# EAGLE schematic GPIO_Splitter (EAGLE 7.1.0)
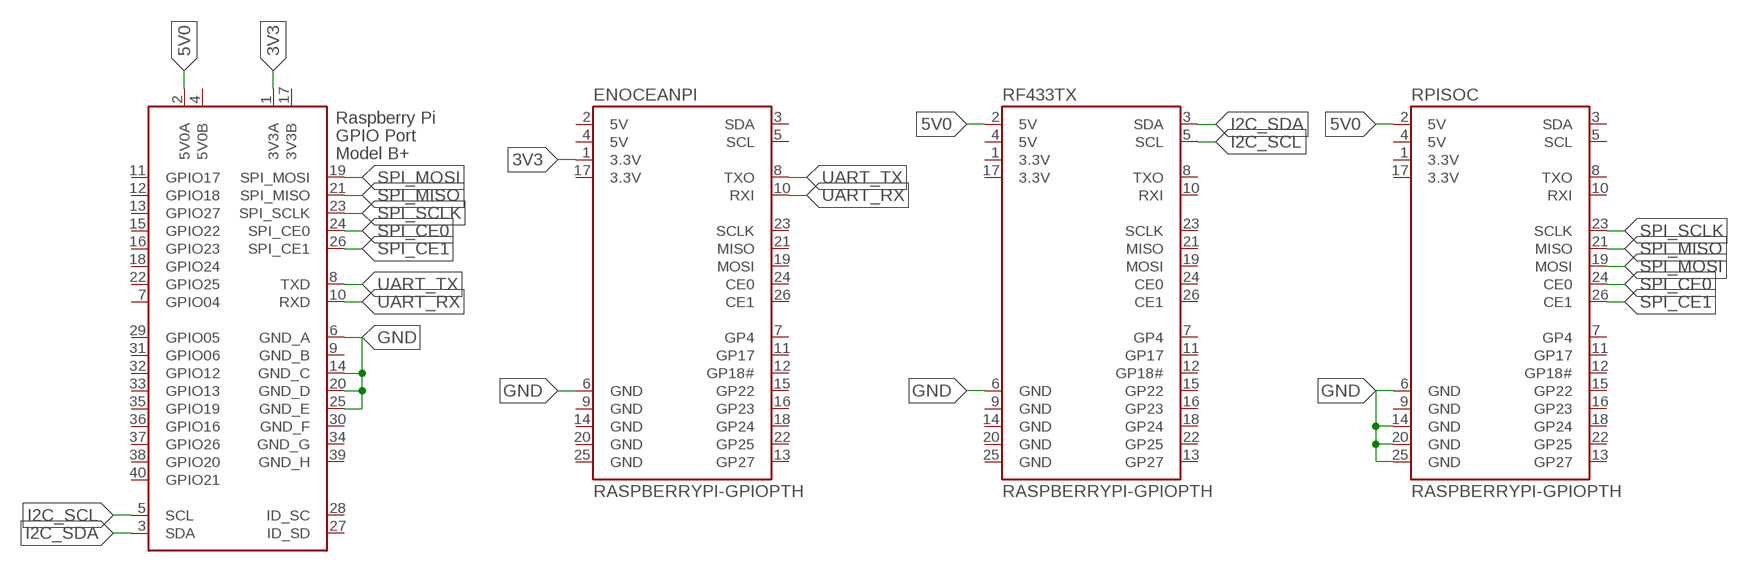
[diagram p0: schematic, sheet 1]

## Parts
ENOCEANPI  RASPBERRYPI-GPIOPTH  [2X13-SHROUDED]
RF433TX  RASPBERRYPI-GPIOPTH  [2X13-SHROUDED]
RPISOC  RASPBERRYPI-GPIOPTH  [2X13-SHROUDED]
X1  RASPI_BOARD_B+#_H  [RASPI_BOARD_B+HAT]

## Nets
3V3: ENOCEANPI.1(3.3V) X1.1(3V3A)
5V0: RF433TX.2(5V) RPISOC.2(5V) X1.2(5V0A)
GND: ENOCEANPI.6(GND) RF433TX.6(GND) RPISOC.6(GND) RPISOC.14(GND) RPISOC.20(GND) RPISOC.25(GND) X1.6(GND_A) X1.14(GND_C) X1.20(GND_D) X1.25(GND_E)
I2C_SCL: RF433TX.5(SCL) X1.5(SCL)
I2C_SDA: RF433TX.3(SDA) X1.3(SDA)
SPI_CE0: RPISOC.24(CE0) X1.24(SPI_CE0)
SPI_CE1: RPISOC.26(CE1) X1.26(SPI_CE1)
SPI_MISO: RPISOC.21(MISO) X1.21(SPI_MISO)
SPI_MOSI: RPISOC.19(MOSI) X1.19(SPI_MOSI)
SPI_SCLK: RPISOC.23(SCLK) X1.23(SPI_SCLK)
UART_RX: ENOCEANPI.10(RXI) X1.10(RXD)
UART_TX: ENOCEANPI.8(TXO) X1.8(TXD)
Unconnected: ENOCEANPI.3(SDA) ENOCEANPI.5(SCL) ENOCEANPI.7(GP4) ENOCEANPI.11(GP17) ENOCEANPI.12(GP18#) ENOCEANPI.13(GP27) ENOCEANPI.15(GP22) ENOCEANPI.16(GP23) ENOCEANPI.18(GP24) ENOCEANPI.19(MOSI) ENOCEANPI.21(MISO) ENOCEANPI.22(GP25) ENOCEANPI.23(SCLK) ENOCEANPI.24(CE0) ENOCEANPI.26(CE1) RF433TX.7(GP4) RF433TX.8(TXO) RF433TX.10(RXI) RF433TX.11(GP17) RF433TX.12(GP18#) RF433TX.13(GP27) RF433TX.15(GP22) RF433TX.16(GP23) RF433TX.18(GP24) RF433TX.19(MOSI) RF433TX.21(MISO) RF433TX.22(GP25) RF433TX.23(SCLK) RF433TX.24(CE0) RF433TX.26(CE1) RPISOC.3(SDA) RPISOC.5(SCL) RPISOC.7(GP4) RPISOC.8(TXO) RPISOC.10(RXI) RPISOC.11(GP17) RPISOC.12(GP18#) RPISOC.13(GP27) RPISOC.15(GP22) RPISOC.16(GP23) RPISOC.18(GP24) RPISOC.22(GP25) X1.7(GPIO04) X1.11(GPIO17) X1.12(GPIO18) X1.13(GPIO27) X1.15(GPIO22) X1.16(GPIO23) X1.18(GPIO24) X1.22(GPIO25) X1.27(ID_SD) X1.28(ID_SC) X1.29(GPIO05) X1.31(GPIO06) X1.32(GPIO12) X1.33(GPIO13) X1.35(GPIO19) X1.36(GPIO16) X1.37(GPIO26) X1.38(GPIO20) X1.40(GPIO21)

## Power pins joined to a net without a drawn wire
3.3V: ENOCEANPI.17(3.3V) RF433TX.1(3.3V) RF433TX.17(3.3V) RPISOC.1(3.3V) RPISOC.17(3.3V)
3V3B: X1.17(3V3B)
5V: ENOCEANPI.2(5V) ENOCEANPI.4(5V) RF433TX.4(5V) RPISOC.4(5V)
5V0B: X1.4(5V0B)
GND: ENOCEANPI.9(GND) ENOCEANPI.14(GND) ENOCEANPI.20(GND) ENOCEANPI.25(GND) RF433TX.9(GND) RF433TX.14(GND) RF433TX.20(GND) RF433TX.25(GND) RPISOC.9(GND)
GND_B: X1.9(GND_B)
GND_F: X1.30(GND_F)
GND_G: X1.34(GND_G)
GND_H: X1.39(GND_H)

## Library data of the parts
ENOCEANPI RF433TX RPISOC = SparkFun-Boards:RASPBERRYPI-GPIO: RASPBERRY PI I/O HEADER As defined for the Revistion 2 Pi.; DIST: sparkfun; DIST_ID: PRT-11490
X1 = raspberrypi_bastelstube_v13:RASPI_BOARD_B+#: Raspberry Pi GPIO connector with markings for the outer dimensions of the Raspberry Pi board model B+ with different sets of drill holes or mounting pads All pins connected